# Altium project UPCR_TEC_module.PrjPcb
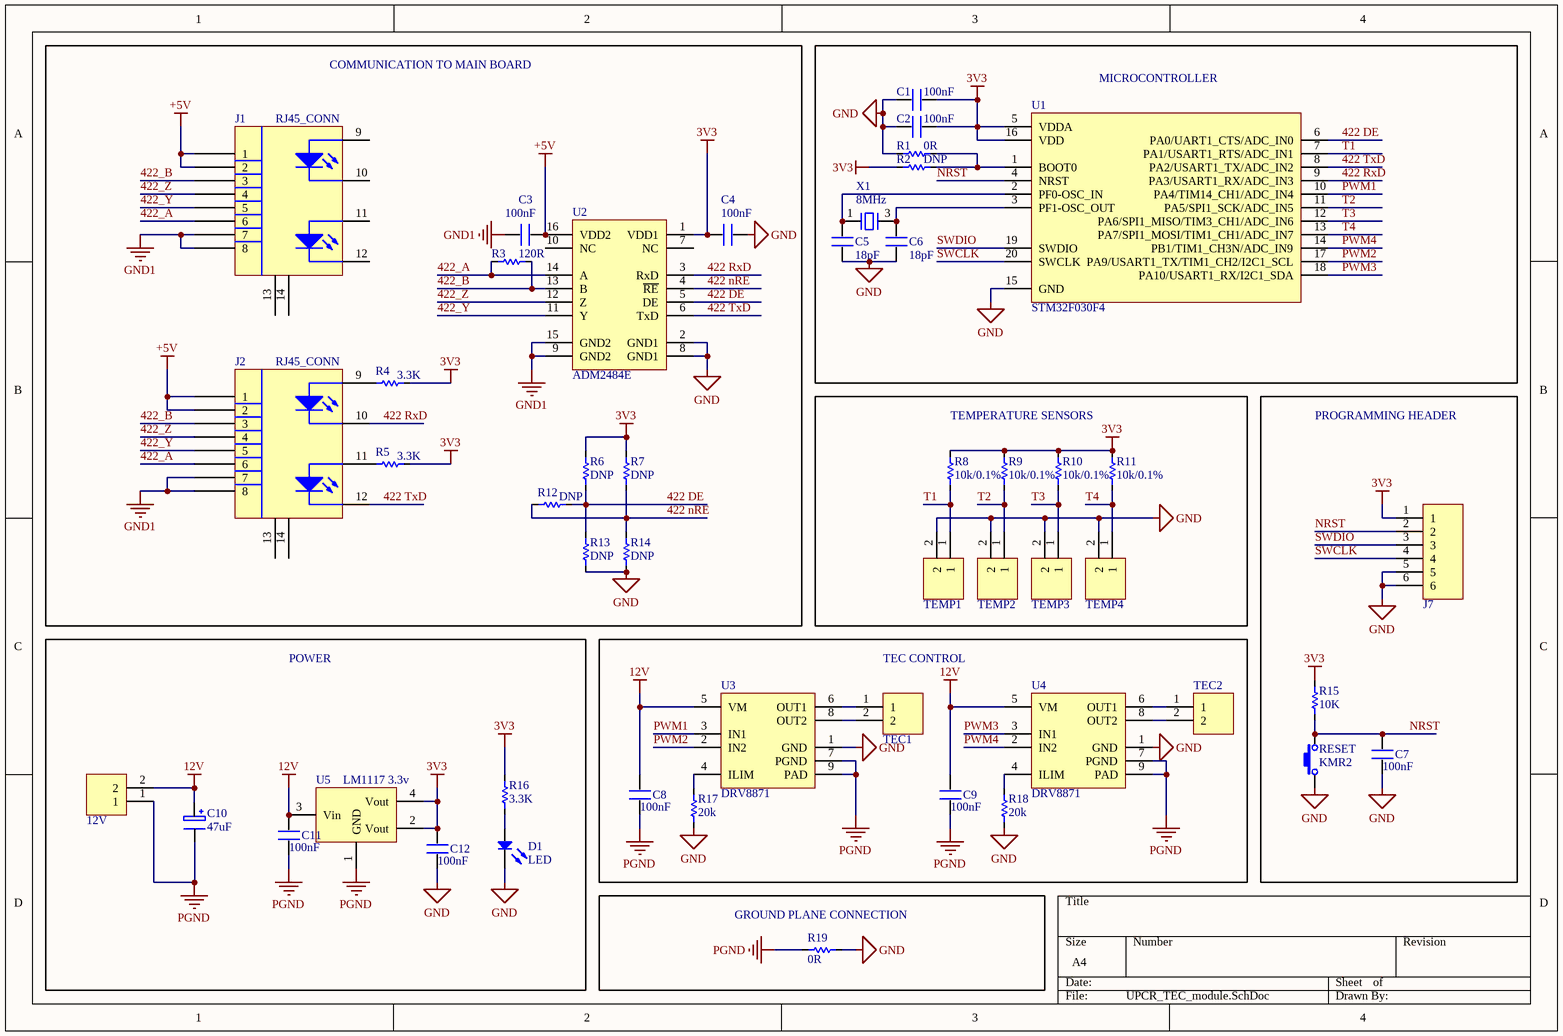
[diagram p0: UPCR_TEC_module.SchDoc]
1 sheet, 49 parts. Net scope: global (net labels, ports and power ports of the same name join across sheets).
Board file: UPCR_TEC_module.PcbDoc

## Sheet UPCR_TEC_module.SchDoc
size A4

### Parts
12V  CONN_2P  [JST B2P-VH]  (value not drawn)
C1  value 100nF  [C0603]  (hidden comment: C)
C2  value 100nF  [C0603]  (hidden comment: C)
C3  value 100nF  [C0603]  (hidden comment: C)
C4  value 100nF  [C0603]  (hidden comment: C)
C5  value 18pF  [C0603]  (hidden comment: C)
C6  value 18pF  [C0603]  (hidden comment: C)
C7  value 100nF  [C0603]  (hidden comment: C)
C8  value 100nF  [C0603]  (hidden comment: C)
C9  value 100nF  [C0603]  (hidden comment: C)
C10  47uF  [CPOL_8x9]
C11  value 100nF  [C0603]  (hidden comment: C)
C12  value 100nF  [C0603]  (hidden comment: C)
D1  LED  [0603 LED]
J1  RJ45_CONN  [RJ45_CONN_V1]
J2  RJ45_CONN  [RJ45_CONN_V1]
J7  CONN_6P  [2.54 6P Header]  (value not drawn)
R1  value 0R  [R0603]  (hidden comment: R)
R2  value DNP  [R0603]  (hidden comment: R)
R3  value 120R  [R0603]  (hidden comment: R)
R4  value 3.3K  [R0603]  (hidden comment: R)
R5  value 3.3K  [R0603]  (hidden comment: R)
R6  value DNP  [R0603]  (hidden comment: R)
R7  value DNP  [R0603]  (hidden comment: R)
R8  value 10k/0.1%  [R0603]  (hidden comment: R)
R9  value 10k/0.1%  [R0603]  (hidden comment: R)
R10  value 10k/0.1%  [R0603]  (hidden comment: R)
R11  value 10k/0.1%  [R0603]  (hidden comment: R)
R12  value DNP  [R0603]  (hidden comment: R)
R13  value DNP  [R0603]  (hidden comment: R)
R14  value DNP  [R0603]  (hidden comment: R)
R15  value 10K  [R0603]  (hidden comment: R)
R16  value 3.3K  [R0603]  (hidden comment: R)
R17  value 20k  [R0603]  (hidden comment: R)
R18  value 20k  [R0603]  (hidden comment: R)
R19  value 0R  [R0603]  (hidden comment: R)
RESET  KMR2  [KMR2_tact_switch]
TEC1  CONN_2P  [JST B2B-XH-A - THIN PADS]  (value not drawn)
TEC2  CONN_2P  [JST B2B-XH-A - THIN PADS]  (value not drawn)
TEMP1  CONN_2P  [JST B2B-PH-K-S]  (value not drawn)
TEMP2  CONN_2P  [JST B2B-PH-K-S]  (value not drawn)
TEMP3  CONN_2P  [JST B2B-PH-K-S]  (value not drawn)
TEMP4  CONN_2P  [JST B2B-PH-K-S]  (value not drawn)
U1  STM32F030F4  [STM32F030F4- TSSOP20]
U2  ADM2484E  [ADM2484-SOIC16]
U3  DRV8871  [DRV8871- SOIC8]
U4  DRV8871  [DRV8871- SOIC8]
U5  LM1117 3.3v  [SOT223]
X1  8MHz  [CRYSTAL_4P_3.2X2.5]

### Blocks framed on the sheet
COMMUNICATION TO MAIN BOARD: C3 C4 J1 J2 R3-R7 R12-R14 U2
MICROCONTROLLER: C1 C2 C5 C6 R1 R2 U1 X1
TEMPERATURE SENSORS: R8-R11 TEMP1-TEMP4
PROGRAMMING HEADER: C7 J7 R15 RESET
POWER: 12V C10-C12 D1 R16 U5
TEC CONTROL: C8 C9 R17 R18 TEC1 TEC2 U3 U4
GROUND PLANE CONNECTION: R19

### Nets
3V3: C1.2 C2.2 C4.1 C12.2 J7.1 R2.2 R4.2 R5.2 R6.1 R7.1 R8.1 R9.1 R10.1 R11.1 R15.1 R16.2 U1.5(VDDA) U1.16(VDD) U2.1(VDD1) U5.2(Vout) U5.4(Vout)
12V: 12V.2 C8.2 C9.2 C10.1 C11.2 U3.5(VM) U4.5(VM) U5.3(Vin)
+5V: C3.2 J1.1 J1.2 J2.1 J2.2 U2.16(VDD2)
GND: C1.1 C2.1 C4.2 C5.1 C6.1 C7.1 C12.1 D1.2(K) J7.5 J7.6 R1.2 R13.2 R14.2 R17.1 R18.1 R19.2 RESET.1 TEMP1.2 TEMP2.2 TEMP3.2 TEMP4.2 U1.15(GND) U2.2(GND1) U2.8(GND1) U3.1(GND) U4.1(GND) X1.2 X1.4
GND1: C3.1 J1.7 J1.8 J2.7 J2.8 U2.9(GND2) U2.15(GND2)
PGND: 12V.1 C8.1 C9.1 C10.2 C11.1 R19.1 U3.7(PGND) U3.9(PAD) U4.7(PGND) U4.9(PAD) U5.1(GND)
422 DE: R6.2 R12.2 R13.1 U1.6(PA0/UART1_CTS/ADC_IN0) U2.5(DE)
422 nRE: R7.2 R12.1 R14.1 U2.4(~{RE})
422 RxD: J2.10 U1.9(PA3/USART1_RX/ADC_IN3) U2.3(RxD)
422 TxD: J2.12 U1.8(PA2/USART1_TX/ADC_IN2) U2.6(TxD)
422_A: J1.6 J2.6 R3.2 U2.14(A)
422_B: J1.3 J2.3 R3.1 U2.13(B)
422_Y: J1.5 J2.5 U2.11(Y)
422_Z: J1.4 J2.4 U2.12(Z)
NRST: C7.2 J7.2 R15.2 RESET.2 U1.4(NRST)
PWM1: U1.10(PA4/TIM14_CH1/ADC_IN4) U3.3(IN1)
PWM2: U1.17(PA9/USART1_TX/TIM1_CH2/I2C1_SCL) U3.2(IN2)
PWM3: U1.18(PA10/USART1_RX/I2C1_SDA) U4.3(IN1)
PWM4: U1.14(PB1/TIM1_CH3N/ADC_IN9) U4.2(IN2)
SWCLK: J7.4 U1.20(SWCLK)
SWDIO: J7.3 U1.19(SWDIO)
T1: R8.2 TEMP1.1 U1.7(PA1/USART1_RTS/ADC_IN1)
T2: R9.2 TEMP2.1 U1.11(PA5/SPI1_SCK/ADC_IN5)
T3: R10.2 TEMP3.1 U1.12(PA6/SPI1_MISO/TIM3_CH1/ADC_IN6)
T4: R11.2 TEMP4.1 U1.13(PA7/SPI1_MOSI/TIM1_CH1/ADC_IN7)
NetC5_2: C5.2 U1.2(PF0-OSC_IN) X1.1
NetC6_2: C6.2 U1.3(PF1-OSC_OUT) X1.3
NetD1_1: D1.1(A) R16.1
NetJ2_9: J2.9 R4.1
NetJ2_11: J2.11 R5.1
NetR1_1: R1.1 R2.1 U1.1(BOOT0)
NetR17_2: R17.2 U3.4(ILIM)
NetR18_2: R18.2 U4.4(ILIM)
NetTEC1_1: TEC1.1 U3.6(OUT1)
NetTEC1_2: TEC1.2 U3.8(OUT2)
NetTEC2_1: TEC2.1 U4.6(OUT1)
NetTEC2_2: TEC2.2 U4.8(OUT2)

Not connected (* = marked no-connect by the designer): J1 9 10 11 12 13 14; J2 13 14; U2 7(NC) 10(NC)

### Library data of the parts
12V TEC1 TEC2 TEMP1-TEMP4 = CONN_2P: Connector, 2P
C1-C9 C11 C12 = C: Ceramic Capacitor SMD
C10 = C_POL: Polarized Capacitor
J7 = CONN_6P: Connector, 6P
R1-R19 = R: Resistor SMD
RESET = TACT_SWITCH: Pushbuttons
U2 = ADM2484E: Isolated RS485/RS-422 transciever
U3 U4 = DRV8871: DRV8871 3.6-A Brushed DC Motor Driver With Internal Current Sense (PWM Control)
U5 = LM1117 3.3v: 800 mA 3.3V Low Dropout Linear Voltage Regulator
X1 = Crystal_4: Crystal Oscillator